# EAGLE design Matrix_Module (EAGLE 6.6.0)
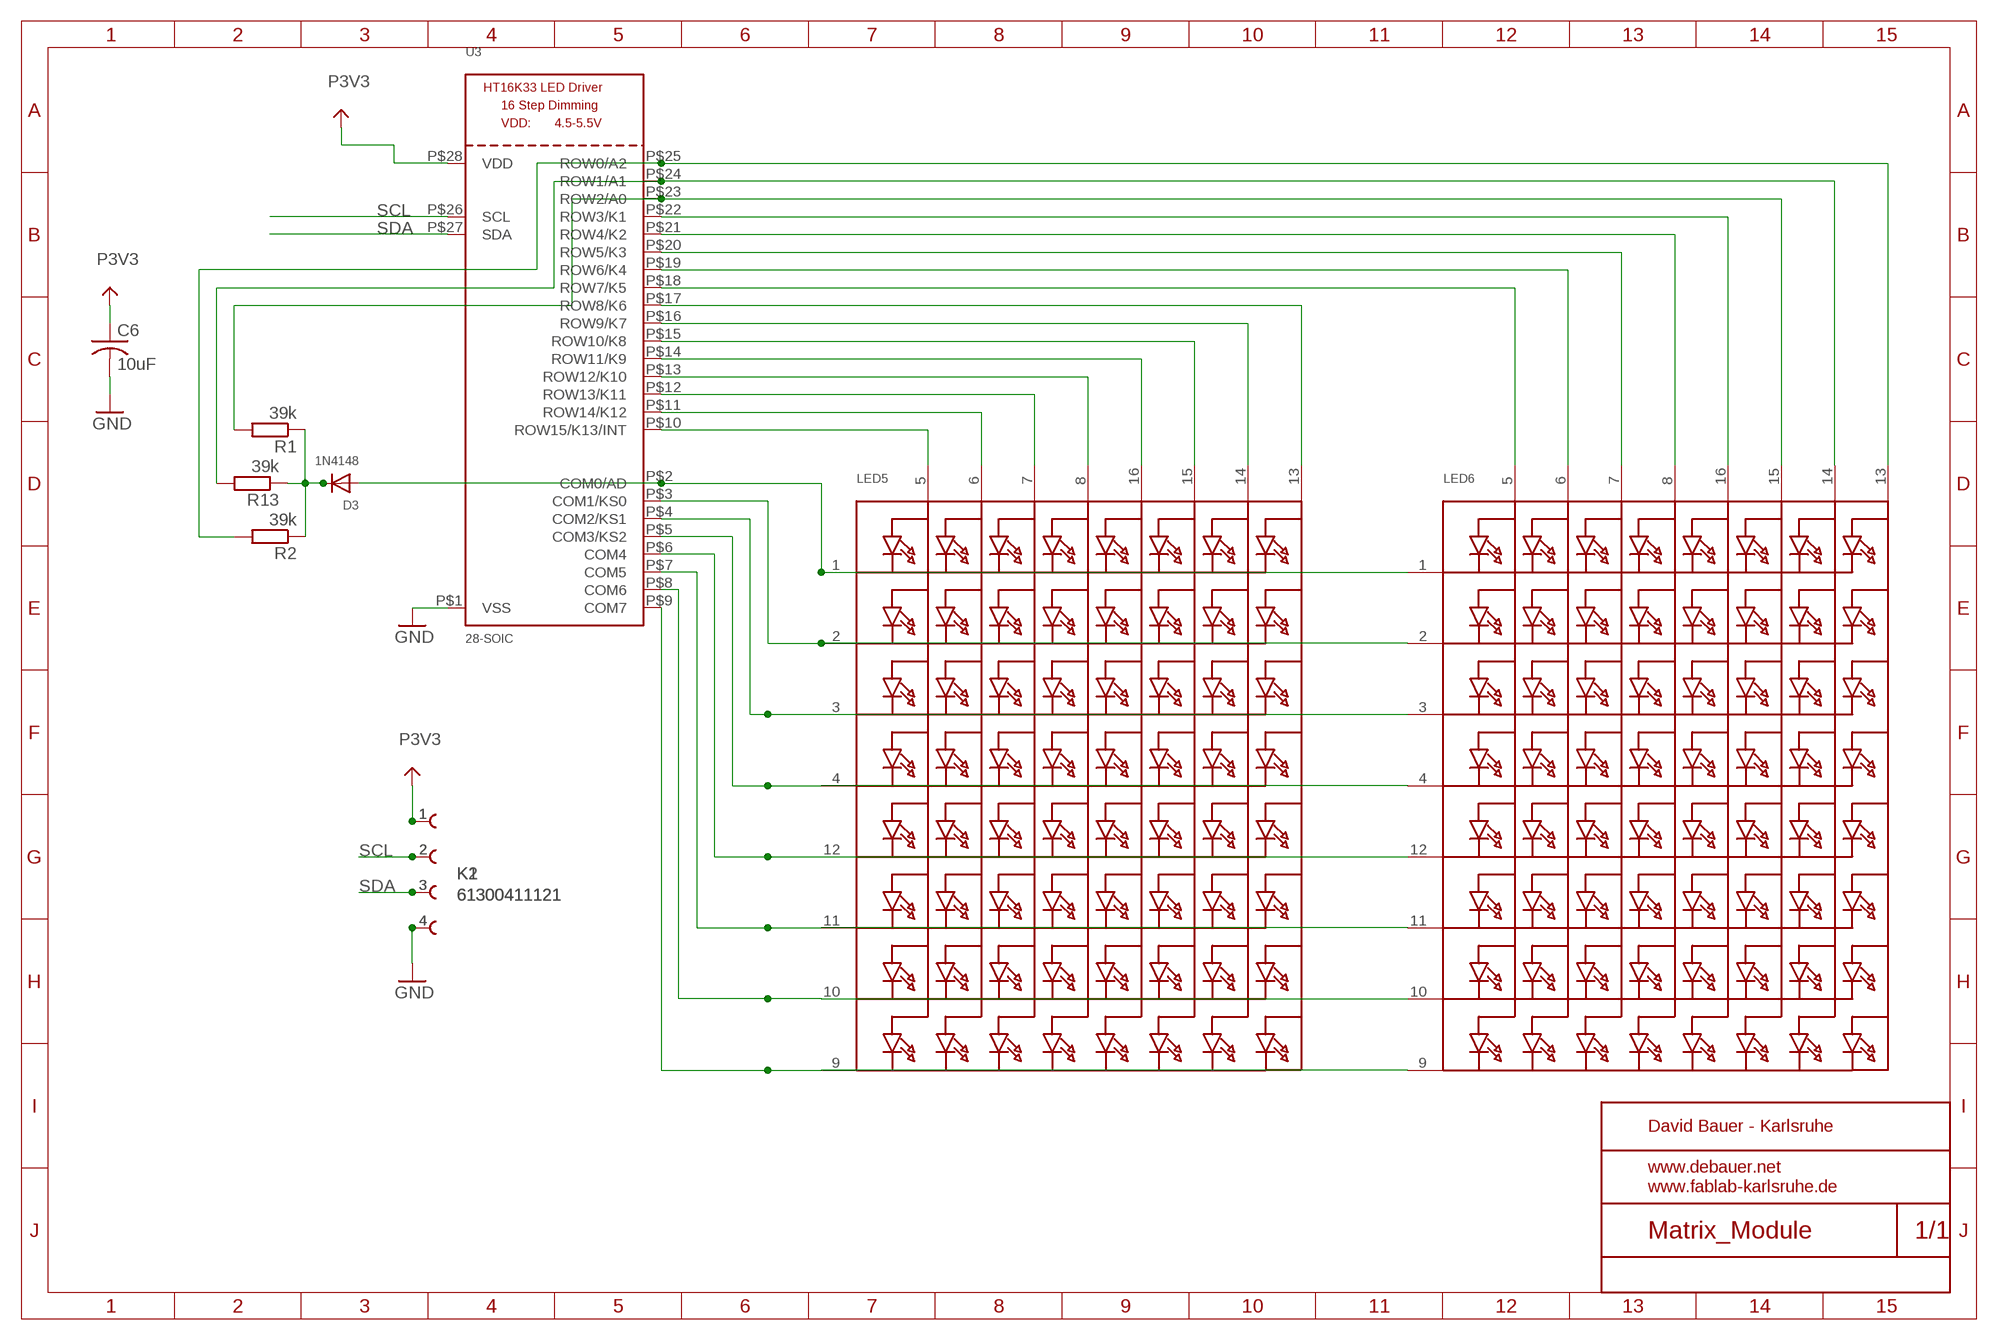
[diagram p0: schematic, sheet 1]

## Parts
C6  10uF  C-USC0805  [C0805]
D3  1N4148  DIODESOD-323F  [SOD-323F]
K1  61300411121  [61300411121]
K2  61300411121  [61300411121]
LED5  SEGMENT_8X8_ROWCATHODE  [SEGMENT_BL-M07C881UR]
LED6  SEGMENT_8X8_ROWCATHODE  [SEGMENT_BL-M07C881UR]
R1  39k  R-EU_R0805  [R0805]
R2  39k  R-EU_R0805  [R0805]
R13  39k  R-EU_R0805  [R0805]
U3  28-SOIC  HT16K33_SOP28  [SOP28_300MIL]

## Nets
GND: C6.2 K1.4 K2.4 U3.P$1(VSS)
N$9: LED6.13(A8) R2.2 U3.P$25(ROW0/A2)
N$10: LED6.14(A7) R13.2 U3.P$24(ROW1/A1)
N$11: LED6.15(A6) R1.2 U3.P$23(ROW2/A0)
N$56: LED5.9(K8) LED6.9(K8) U3.P$9(COM7)
N$57: LED5.10(K7) LED6.10(K7) U3.P$8(COM6)
N$58: LED5.11(K6) LED6.11(K6) U3.P$7(COM5)
N$59: LED5.12(K5) LED6.12(K5) U3.P$6(COM4)
N$60: LED5.4(K4) LED6.4(K4) U3.P$5(COM3/KS2)
N$61: LED5.3(K3) LED6.3(K3) U3.P$4(COM2/KS1)
N$64: LED5.6(A2) U3.P$11(ROW14/K12)
N$65: LED5.7(A3) U3.P$12(ROW13/K11)
N$66: LED6.5(A1) U3.P$18(ROW7/K5)
N$67: LED6.8(A4) U3.P$21(ROW4/K2)
N$68: LED6.7(A3) U3.P$20(ROW5/K3)
N$69: LED5.13(A8) U3.P$17(ROW8/K6)
N$70: LED5.14(A7) U3.P$16(ROW9/K7)
N$71: LED5.16(A5) U3.P$14(ROW11/K9)
N$72: LED5.15(A6) U3.P$15(ROW10/K8)
N$73: LED5.8(A4) U3.P$13(ROW12/K10)
N$74: LED5.5(A1) U3.P$10(ROW15/K13/INT)
N$76: D3.C R1.1 R2.1 R13.1
N$77: LED6.16(A5) U3.P$22(ROW3/K1)
N$78: LED6.6(A2) U3.P$19(ROW6/K4)
N$79: D3.A LED5.1(K1) LED6.1(K1) U3.P$2(COM0/AD)
N$80: LED5.2(K2) LED6.2(K2) U3.P$3(COM1/KS0)
P3V3: C6.1 K1.1 K2.1 U3.P$28(VDD)
SCL: K1.2 K2.2 U3.P$26(SCL)
SDA: K1.3 K2.3 U3.P$27(SDA)

## Library data of the parts
C6 = rcl:C-US: CAPACITOR, American symbol
D3 = adafruit:DIODE: Diode SMADIODE - SMA Surface Mount Package 20V 1A Schottky Diode Digikey: 641-1014-6-ND DO-1N4148 - Through Hole Small Current Diode SOD-123 20V 1 A (.5mV Vf) Schottky Diode - Digikey: MBRX120TPMSCT-ND SOD-323 10V 570mA (.38mV Vf, 3ns) Schottky Diode - Digikey: ZLLS410CT-ND SOD-523 30V 30mA Schottky Diode (RB751S-40TE61) - Digikey: RB751S-40TE61CT-ND SOT23-R/W - SOT23 Package (R = Solder Paste/Reflow Ovens, W = Hand-Soldering) BAT54Film 40V 300mA - Digikey: 497-7162-1-ND
K1 K2 = Wuerth_Board-to-Board:61300411121: WR-PHD 2.54mm Pin Header, 4 Pin =>Code : Con_BTB_PHD_2.54_1_THT_61300411121 <http://katalog.we-online.de/media/images/eican/Con_BTB_PHD_2.54_1_THT_6130xx11121_pf2.jpg> Details see: http://katalog.we-online.de/en/em/613_0xx_111_21 Created 2014-05-29, Karrer Zheng 2014 (C) Würth Elektronik
LED5 LED6 = debauer_modules:SEGMENT_8X8_ROWCATHODE: 8x8 LED Segment Displays: Row = Cathode 0.7" Red 8X8 Matrix, 1.9mm Round LEDs - BL-M07C881UR 1.2" Red 8x8 Matrix, 3.0mm Round LEDs - BL-M12A881UR 1.2" Red 8x8 Matrix, 3.0mm Square LEDs - BL-M12A883
R1 R2 R13 = debauer_passiv:R-EU_: RESISTOR, European symbol
U3 = microbuilder:HT16K33_SOP28

## Net classes
2 gnd: width 0.254 mm, drill 0.254 mm, clearance 0.178 mm
3 usbvcc: width 0.203 mm, drill 0.406 mm, clearance 0.178 mm
4 USBpair: width 0.254 mm, drill 0.406 mm, clearance 0.508 mm

## Board
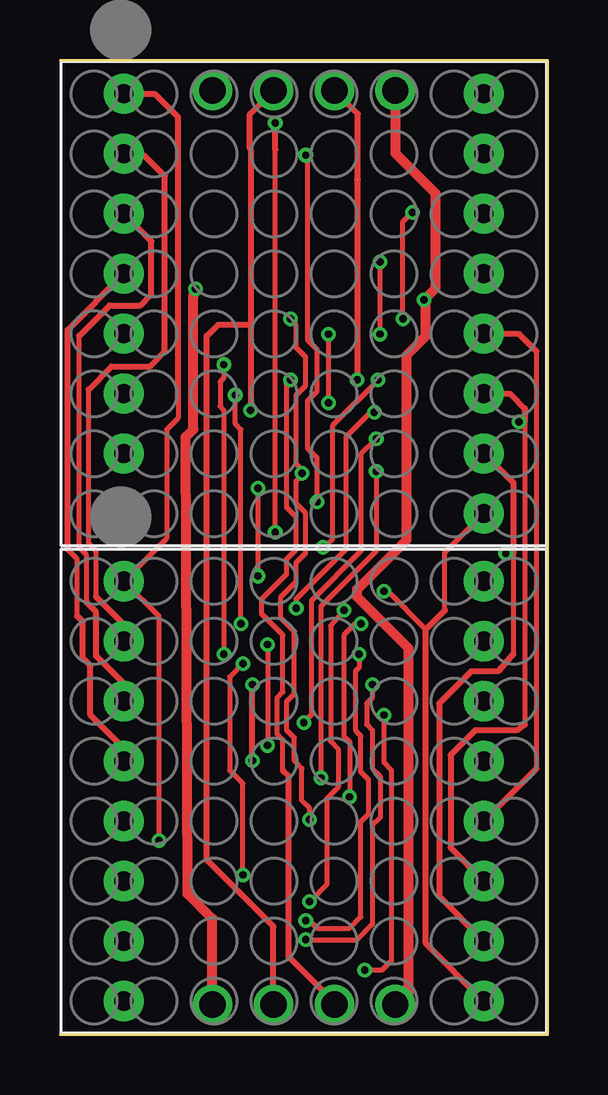
[diagram p1: board, top side]
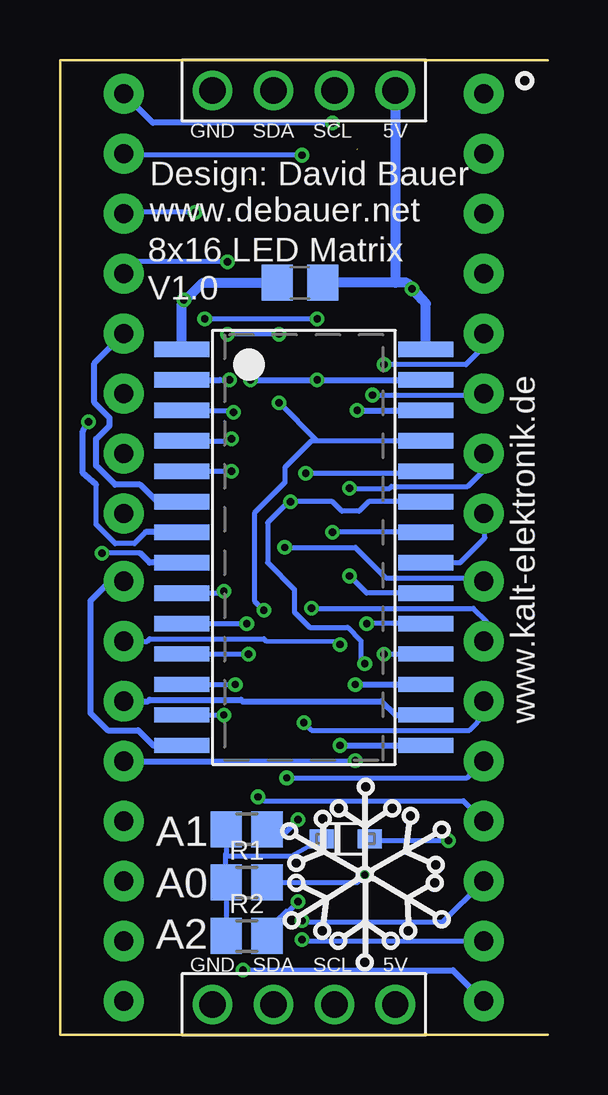
[diagram p2: board, bottom side, seen from below]

Size 20.32 x 40.64 mm. Coordinates in mm from the lower left corner, seen from the top.
Outline: 0,0 20.32,0 20.32,40.64 0,40.64
Copper layers (1*16): Top 0.035mm / dielectric 1.5mm / Bottom 0.035mm
Design rules "ITEADstudioDRC": minimum track width 6mil, minimum drill 12mil, track to track 6mil, track to pad 6mil, pad to pad 6mil, via to via 6mil, smd to smd 0mil, copper to edge 10mil, drill to drill 10mil, minimum pad ring 10mil, minimum via ring 6mil, stop-mask expansion 2mil, vias tented up to drill 100mil, thermal gap 10mil

### Footprints (pad centres in the part's own frame; a part is rotated, then mirrored left to right if it is on the bottom)
C0805 = smd 1.3 x 1.5: 1 -0.95,0; 2 0.95,0
SOD-323F = smd 1 x 0.8: A -1,0; C 1,0
61300411121 = drill 1.1: 1 -3.81,0; 2 -1.27,0; 3 1.27,0; 4 3.81,0
SEGMENT_BL-M07C881UR = drill 0.8 pad 1.676: 1 -8.75,-7.5; 2 -6.25,-7.5; 3 -3.75,-7.5; 4 -1.25,-7.5; 5 1.25,-7.5; 6 3.75,-7.5; 7 6.25,-7.5; 8 8.75,-7.5; 9 8.75,7.5; 10 6.25,7.5; 11 3.75,7.5; 12 1.25,7.5; 13 -1.25,7.5; 14 -3.75,7.5; 15 -6.25,7.5; 16 -8.75,7.5
R0805 = smd 1.3 x 1.5: 1 -0.85,0; 2 0.85,0
SOP28_300MIL = smd 0.635 x 2.286: P$1 -8.255,-5.08; P$2 -6.985,-5.08; P$3 -5.715,-5.08; P$4 -4.445,-5.08; P$5 -3.175,-5.08; P$6 -1.905,-5.08; P$7 -0.635,-5.08; P$8 0.635,-5.08; P$9 1.905,-5.08; P$10 3.175,-5.08; P$11 4.445,-5.08; P$12 5.715,-5.08; P$13 6.985,-5.08; P$14 8.255,-5.08; P$15 8.255,5.08; P$16 6.985,5.08; P$17 5.715,5.08; P$18 4.445,5.08; P$19 3.175,5.08; P$20 1.905,5.08; P$21 0.635,5.08; P$22 -0.635,5.08; P$23 -1.905,5.08; P$24 -3.175,5.08; P$25 -4.445,5.08; P$26 -5.715,5.08; P$27 -6.985,5.08; P$28 -8.255,5.08

### Placement (x,y rotation side)
C6  10.32,31.35 180 bottom
D3  8.41,8.18 180 bottom
K1  10.16,39.37 180 bottom
K2  10.16,1.27 180 bottom
LED5  10.16,10.16 270 top
LED6  10.16,30.48 270 top
R1  12.54,6.35 0 bottom
R2  12.54,4.13 0 bottom
R13  12.54,8.57 0 bottom
U3  10.16,20.32 270 bottom
U$1  [SNOW]  7.62,7.06 0 bottom

### Tracks (layer width: path | path; a pad name or v marks a point on that pad's centre or on a via)
GND  (via drill 0.3)
  Top 0.406: K1.4 13.97,36.75 15.64,35.08 15.64,31.11 v15.16,30.64 | v15.16,30.64 15.12,30.6 | K2.4 14.05,1.27 14.53,1.75 14.53,16.11 12.38,18.26 12.38,18.57 14.45,20.64 14.45,28.34 15.24,29.13 15.24,30.56 v15.16,30.64
  Bottom 0.406: U3.P$1 15.24,30.48 15.16,30.56 | 15.16,30.56 14.37,31.35 C6.2 | v15.16,30.64 15.16,30.56
N$9  (via drill 0.3)
  Top 0.216: v11.19,26.35 v11.19,29.21 | v13.34,29.21 v13.34,32.23 | v11.83,17.7 11.27,17.07 11.27,12.22 11.59,11.91 11.59,10.32 11.11,9.84 11.11,6.27 v10.4,5.56
  Bottom 0.216: U3.P$25 9.6,24.77 | 9.6,24.77 v11.19,26.35 | v11.19,29.21 v13.34,29.21 | v13.34,32.23 17.16,32.23 LED6.13 | 9.6,24.77 9.84,24.77 10.95,23.65 10.95,23.02 12.22,21.75 12.22,18.1 v11.83,17.7 | v10.4,5.56 10.79,5.16 10.87,5.16 11.35,4.68 11.35,4.47 R2.2
N$10  (via drill 0.3)
  Top 0.216: v10.4,8.97 10.4,9.45 10.08,9.76 10.08,11.11 9.84,11.35 9.76,11.43 9.76,12.38 9.45,12.7 9.45,13.89 9.76,14.21 9.76,16.83 9.21,17.38 9.21,18.26 9.84,18.89 9.84,19.68 10.24,20.08 10.24,21.75 9.84,22.15 9.84,23.1 10.08,23.34 v10.08,23.42 10.08,23.57 9.84,23.81 9.84,26.67 10.24,27.07 10.24,28.26 9.84,28.65 9.84,29.61 v9.6,29.84 | v14.29,29.84 14.29,33.89 v14.68,34.29
  Bottom 0.216: R13.2 11.19,8.18 v10.4,8.97 | v10.08,23.42 5.16,23.42 U3.P$24 | v9.6,29.84 v14.29,29.84 | v14.68,34.29 17.6,34.29 LED6.14
N$11  (via drill 0.3)
  Top 0.216: v10.72,22.23 10.72,24.05 10.32,24.45 10.32,26.43 10.72,26.83 10.72,28.57 10.32,28.97 10.32,36.59 v10.24,36.67 | v7.62,15.48 7.06,14.92 7.06,11.03 7.62,10.48 v7.62,6.67
  Bottom 0.216: U3.P$23 7.46,22.23 7.86,21.83 8.57,21.83 8.97,22.23 v10.72,22.23 10.79,22.23 11.67,21.35 11.67,19.68 10.56,18.57 10.56,17.62 9.92,16.99 8.33,16.99 7.78,16.43 7.78,15.64 v7.62,15.48 | v10.24,36.67 17.6,36.67 LED6.15 | R1.2 7.94,6.35 v7.62,6.67
N$56  (via drill 0.3)
  Top 0.216: 16.03,17.7 16.03,20.1 LED6.9 | v13.49,18.49 13.65,18.49 15.24,16.91
  Top 0.254: LED5.9 17.64,1.41 15.24,3.81 15.24,16.91 16.03,17.7
  Bottom 0.216: U3.P$9 13.57,18.41 v13.49,18.49
N$57  (via drill 0.3)
  Top 0.216: 18.89,20.08 18.89,15.88
  Top 0.254: LED6.10 18.71,23.2 18.89,23.02 18.89,20.08 v18.57,20.08 | 18.89,15.88 18.26,15.16 17.14,15.16 15.8,13.81 15.8,5.77 LED5.10
  Bottom 0.216: 16.99,20.08 18.41,20.08
  Bottom 0.254: U3.P$8 16.59,19.68 16.99,20.08 | 18.41,20.08 v18.57,20.08
N$58  (via drill 0.3)
  Top 0.216: 19.37,25.56 19.37,12.94
  Top 0.254: LED6.11 18.75,26.73 19.37,26.11 19.37,25.56 v19.13,25.56 | 19.37,12.94 19.05,12.7 17.3,12.7 16.27,11.67 16.27,7.8 LED5.11
  Bottom 0.216: 16.75,20.95 17.22,20.48 18.02,20.48 18.81,21.27 18.81,22.94
  Bottom 0.254: U3.P$7 16.75,20.95 | 18.81,22.94 19.37,23.42 19.37,25.16 v19.13,25.56
N$59
  Top 0.216: 19.84,28.5 19.84,11.09
  Top 0.254: LED6.12 19.11,29.23 19.84,28.5 | 19.84,11.09 LED5.12
  Bottom 0.254: U3.P$6 16.27,22.23 16.99,22.94 18.02,22.94 18.81,23.73 18.81,24.84 18.26,25.4 18.26,25.72 18.89,26.35 18.89,28 LED6.12
N$60  (via drill 0.3)
  Top 0.216: 0.71,17.46 0.71,19.84 0.32,20.24 | v13.18,23.5 13.18,20.16 10.87,17.86 v10.87,10.72
  Top 0.254: LED5.4 2.66,11.95 1.27,13.34 1.27,15.4 0.95,15.72 0.95,17.22 0.71,17.46 | 0.32,20.24 0.32,29.39 LED6.4
  Bottom 0.216: U3.P$5 v13.18,23.5 | v10.87,10.72 3.35,10.72 LED5.4
N$61  (via drill 0.3)
  Top 0.216: 1.11,18.02 1.11,20 0.79,20.32 0.79,29.13 | v13.18,24.84 12.54,24.21 12.54,20.16 10.48,18.1 10.48,13.34 v10.16,13.02
  Top 0.254: LED5.3 2.66,14.64 1.51,15.8 1.51,17.62 1.11,18.02 | 0.79,29.13 2.06,30.4 3.33,30.4 3.81,30.88 3.81,33.08 LED6.3
  Bottom 0.216: U3.P$4 13.26,24.77 v13.18,24.84 | v10.16,13.02 9.84,12.7 3.25,12.7 2.62,13.34 2.62,13.87 LED5.3
N$64  (via drill 0.3)
  Top 0.216: v12.46,15.88 12.46,15.32 12.3,15.16 12.3,12.7 12.54,12.46 12.54,10.95 12.86,10.64 12.86,9.21 12.54,8.89 12.54,4.92 12.06,4.45 10.72,4.45 10.4,4.76 v10.24,4.76
  Bottom 0.216: U3.P$11 v12.46,15.88 | 2.68,6.43 LED5.6 4.39,4.68 10.16,4.68 v10.24,4.76
N$65  (via drill 0.3)
  Top 0.216: v13.02,14.61 13.02,14.05 12.78,13.81 12.78,12.94 13.02,12.7 13.02,11.11 13.34,10.79 13.34,9.05 13.02,8.73 13.02,4.6 12.38,3.97 v10.24,3.97
  Bottom 0.216: U3.P$12 v13.02,14.61 | LED5.7 10.18,3.91 v10.24,3.97
N$66  (via drill 0.3)
  Top 0.216: v6.83,27.94 6.83,27.38 6.67,27.23 6.67,26.19 6.83,26.04 v6.83,15.88
  Bottom 0.216: LED6.5 2.66,28.69 3.41,27.94 v6.83,27.94 | v6.83,15.88 U3.P$18
N$67
  Bottom 0.216: U3.P$21 3.65,19.68 2.62,20.72 2.62,21.69 LED6.8
N$68  (via drill 0.3)
  Top 0.216: v8.26,19.13 v8.26,22.78
  Bottom 0.216: U3.P$20 7.54,18.41 v8.26,19.13 | v8.26,22.78 6.59,22.78 6.51,22.86 3.33,22.86 2.62,23.57 2.62,24.19 LED6.7
N$69  (via drill 0.3)
  Top 0.254: v8.02,11.43 v8.02,14.61
  Bottom 0.254: LED5.13 8.04,11.41 v8.02,11.43 | v8.02,14.61 U3.P$17
N$70
  Bottom 0.254: LED5.14 16.65,13.91 16.59,13.97 12.78,13.97 12.7,13.89 6.92,13.91 6.35,13.34 U3.P$16
N$71
  Bottom 0.254: LED5.16 18.24,18.91 19.05,18.1 19.05,13.41 18.34,12.7 17.07,12.7 16.43,12.06 U3.P$14
N$72  (via drill 0.3)
  Top 0.216: v8.65,16.27 v8.65,12.06
  Bottom 0.216: LED5.15 16.69,16.41 16.59,16.51 11.83,16.51 11.75,16.43 8.75,16.41
  Bottom 0.254: 8.75,16.41 v8.65,16.27 | v8.65,12.06 U3.P$15
N$73  (via drill 0.3)
  Top 0.216: v13.49,13.34 13.49,11.35 13.81,11.03 13.81,3.1 13.41,2.7 v12.7,2.7
  Bottom 0.216: U3.P$13 v13.49,13.34 | 2.68,1.43 LED5.8
  Bottom 0.254: v12.7,2.7 3.95,2.7 LED5.8
N$74  (via drill 0.3)
  Top 0.216: v12.54,17.14 12.3,17.14 11.83,16.67 11.83,12.46 12.06,12.22 v12.06,9.92
  Bottom 0.216: U3.P$10 v12.54,17.14 | v12.06,9.92 11.91,9.84 11.83,9.76 3.51,9.76 LED5.5
N$76
  Bottom 0.216: R13.1 13.39,7.6 13.41,7.54 13.41,7.46 | 13.41,7.46 10.68,7.46 D3.C | R2.1 R1.1 13.39,6.37 13.41,7.46
N$77  (via drill 0.3)
  Top 0.216: v8.97,20.95 8.97,36.91
  Top 0.254: 8.97,36.91 v8.97,38.02
  Bottom 0.216: U3.P$22 v8.97,20.95
  Bottom 0.254: v8.97,38.02 16.45,38.02 LED6.16
N$78  (via drill 0.3)
  Top 0.216: v7.54,17.14 7.54,25.24 7.3,25.48 v7.3,26.67
  Bottom 0.216: U3.P$19 v7.54,17.14 | v7.3,26.67 2.72,26.67 LED6.6
N$79  (via drill 0.3)
  Top 0.216: v13.26,27.3 11.35,25.4 11.35,20.64 v10.95,20.32 | v4.13,8.1 4.13,17.44 LED5.1 4.45,20.7 4.45,25.24 4.92,25.72 4.92,26.59
  Top 0.254: 4.92,26.59 4.92,38.26 3.97,39.21 2.68,39.21 LED6.1
  Bottom 0.216: 13.65,27.3 v13.26,27.3 | v10.95,20.32 8.02,20.32 6.75,19.05 2.8,19.05 LED5.1 | v4.13,8.1 7.33,8.1 D3.A
  Bottom 0.254: U3.P$2 13.65,27.3
N$80  (via drill 0.3)
  Top 0.216: 1.51,18.26 1.51,20.16 1.19,20.48 1.19,26.91 | v13.1,25.96 12.94,25.96 11.91,24.92 11.91,20.24 9.84,18.18 v9.84,17.78
  Top 0.254: LED5.2 2.66,17.1 1.51,18.26 | 1.19,26.91 2.14,27.86 3.73,27.86 4.37,28.5 4.37,35.8 3.49,36.67 2.72,36.67 LED6.2
  Bottom 0.216: U3.P$3 13.18,26.04 v13.1,25.96 | v9.84,17.78 3.1,17.78 2.54,17.22 2.54,16.53 LED5.2
P3V3  (via drill 0.3)
  Top 0.406: K2.1 6.35,4.84 5.32,5.87 5.24,24.92 5.56,25.24 5.56,30.77 v5.65,31.1
  Bottom 0.406: U3.P$28 5.08,30.48 5.27,30.69 | 5.27,30.69 v5.65,31.1 | v5.65,31.1 5.87,31.35 6.35,31.35 | 6.35,31.35 C6.1 | K1.1 6.35,31.35 | v5.65,31.1 5.65,31.07 5.27,30.69
SCL  (via drill 0.3)  (1 unrouted)
  Top 0.254: 7.94,36.91 7.94,29.61 | 7.94,29.61 v7.94,26.04 | 7.91,36.94 7.91,38.39 K1.2 | K2.2 8.89,4.52 6.11,7.3 6.11,29.13 6.59,29.61 7.94,29.61
  Bottom 0.254: v7.94,26.04 U3.P$26
SDA  (via drill 0.3)  (1 unrouted)
  Top 0.216: 9.29,11.03 9.29,12.3 9.05,12.54 9.05,14.05 9.29,14.29 9.29,16.67 8.41,17.54 8.41,18.18 9.45,19.21 9.45,19.84 9.84,20.24 9.84,21.59 9.45,21.99 9.45,27.15
  Top 0.254: 12.38,35.64 v12.38,27.3 | 12.41,35.67 12.41,38.39 K1.3 | K2.3 11.43,1.35 9.53,3.25 9.53,10.79 9.29,11.03 | 9.45,27.15 v9.6,27.3
  Bottom 0.254: v12.38,27.3 v9.6,27.3 U3.P$27

### Text on the board
bPlace: 5V | SCL | SDA | GND | Design: David Bauer | www.debauer.net | 8x16 LED Matrix | V1.0 | www.kalt-elektronik.de | A1 | A0 | A2 | 5V | SCL | SDA | GND